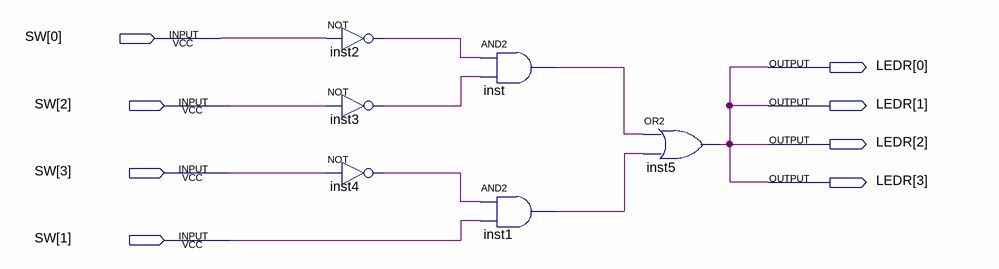
[diagram p0: schematic sheet]
// Quartus schematic part3_circuit2.bdf as structural Verilog: 6 symbols, 8 pins
module part3_circuit2 (
  input  [3:0] SW,
  output [3:0] LEDR
);

  wire inst1_out, inst2_out, inst3_out, inst4_out, inst_out;

  not inst2 (inst2_out, SW[0]);
  not inst3 (inst3_out, SW[2]);
  not inst4 (inst4_out, SW[3]);
  and inst (inst_out, inst2_out, inst3_out);
  and inst1 (inst1_out, inst4_out, SW[1]);
  or inst5 (LEDR[3], inst_out, inst1_out);

  assign LEDR[2:0] = {3{LEDR[3]}};
endmodule
